# Altium schematic sheet modul L298.SchDoc
size A
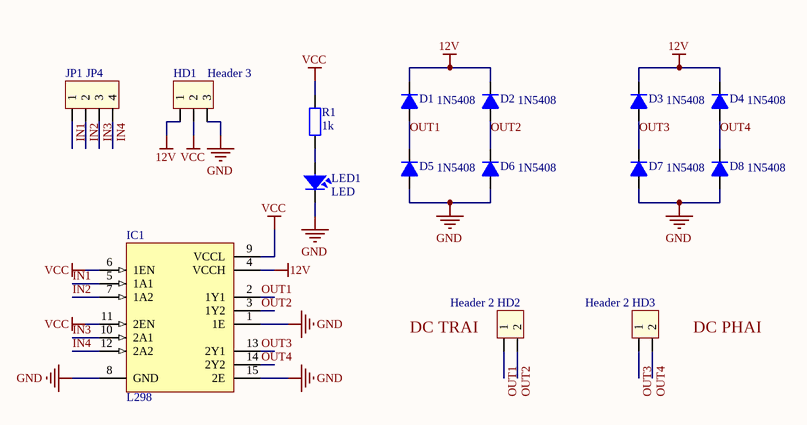
[diagram p0: modul L298.SchDoc]

## Parts
D1  1N5408  [D5A]
D2  1N5408  [D5A]
D3  1N5408  [D5A]
D4  1N5408  [D5A]
D5  1N5408  [D5A]
D6  1N5408  [D5A]
D7  1N5408  [D5A]
D8  1N5408  [D5A]
HD1  Header 3  [HED3]
HD2  Header 2  [HED2]
HD3  Header 2  [HED2]
IC1  L298  [DIP15SL2]
JP1  JP4  [CON4]
LED1  LED  [LED-3]
R1  1k  [R1/4W]

## Nets
12V: D1.2(K) D2.2(K) D3.2(K) D4.2(K) HD1.1 IC1.4(VCCH)
GND: D5.1(A) D6.1(A) D7.1(A) D8.1(A) HD1.3 IC1.1(1E) IC1.8(GND) IC1.15(2E) LED1.2
VCC: HD1.2 IC1.6(1EN) IC1.9(VCCL) IC1.11(2EN) R1.2
IN1: IC1.5(1A1) JP1.1
IN2: IC1.7(1A2) JP1.2
IN3: IC1.10(2A1) JP1.3
IN4: IC1.12(2A2) JP1.4
OUT1: D1.1(A) D5.2(K) HD2.1 IC1.2(1Y1)
OUT2: D2.1(A) D6.2(K) HD2.2 IC1.3(1Y2)
OUT3: D3.1(A) D7.2(K) HD3.1 IC1.13(2Y1)
OUT4: D4.1(A) D8.2(K) HD3.2 IC1.14(2Y2)
NetLED1_1: LED1.1 R1.1

## Notes on the sheet
- Labels drawn without touching a wire or pin: DC PHAI, DC TRAI

## Library data of the parts
D1-D8 = D5A: Diode 5A; Value: 1N5408
HD1 = Hed3: Header 3 (Green); Value: Header 3
HD2 HD3 = Hed2: Header 2 (Green); Value: Header 2
IC1 = L298: Dual Full-H Driver; Note: The tab is elec is connected to GND pin; Published: 15-May-2002; DatasheetVersion: Jun-1990; PackageReference: KV015; Publisher: Altium Limited; PackageDescription: TO, Thru-Hole, Vertical, Heatsink Mounted; 15 Bent Staggered Leads; Pitch 1.27 mm; ComponentLink1Description: Manufacturer Link; ComponentLink1URL: http://www.ti.com/
JP1 = Con4: Connector 4; Value: Connector 4
LED1 = LED: LED Single colour Green and Red; Value: LED 3 ly Single Colour; Description: LED 5 ly Single Colour; Description: Led  Vuong
R1 = R1/4W: Resistor 1/4W; Value: R1/4W - 1K